# EAGLE design HAUPTPCB (EAGLE 7.1.0)
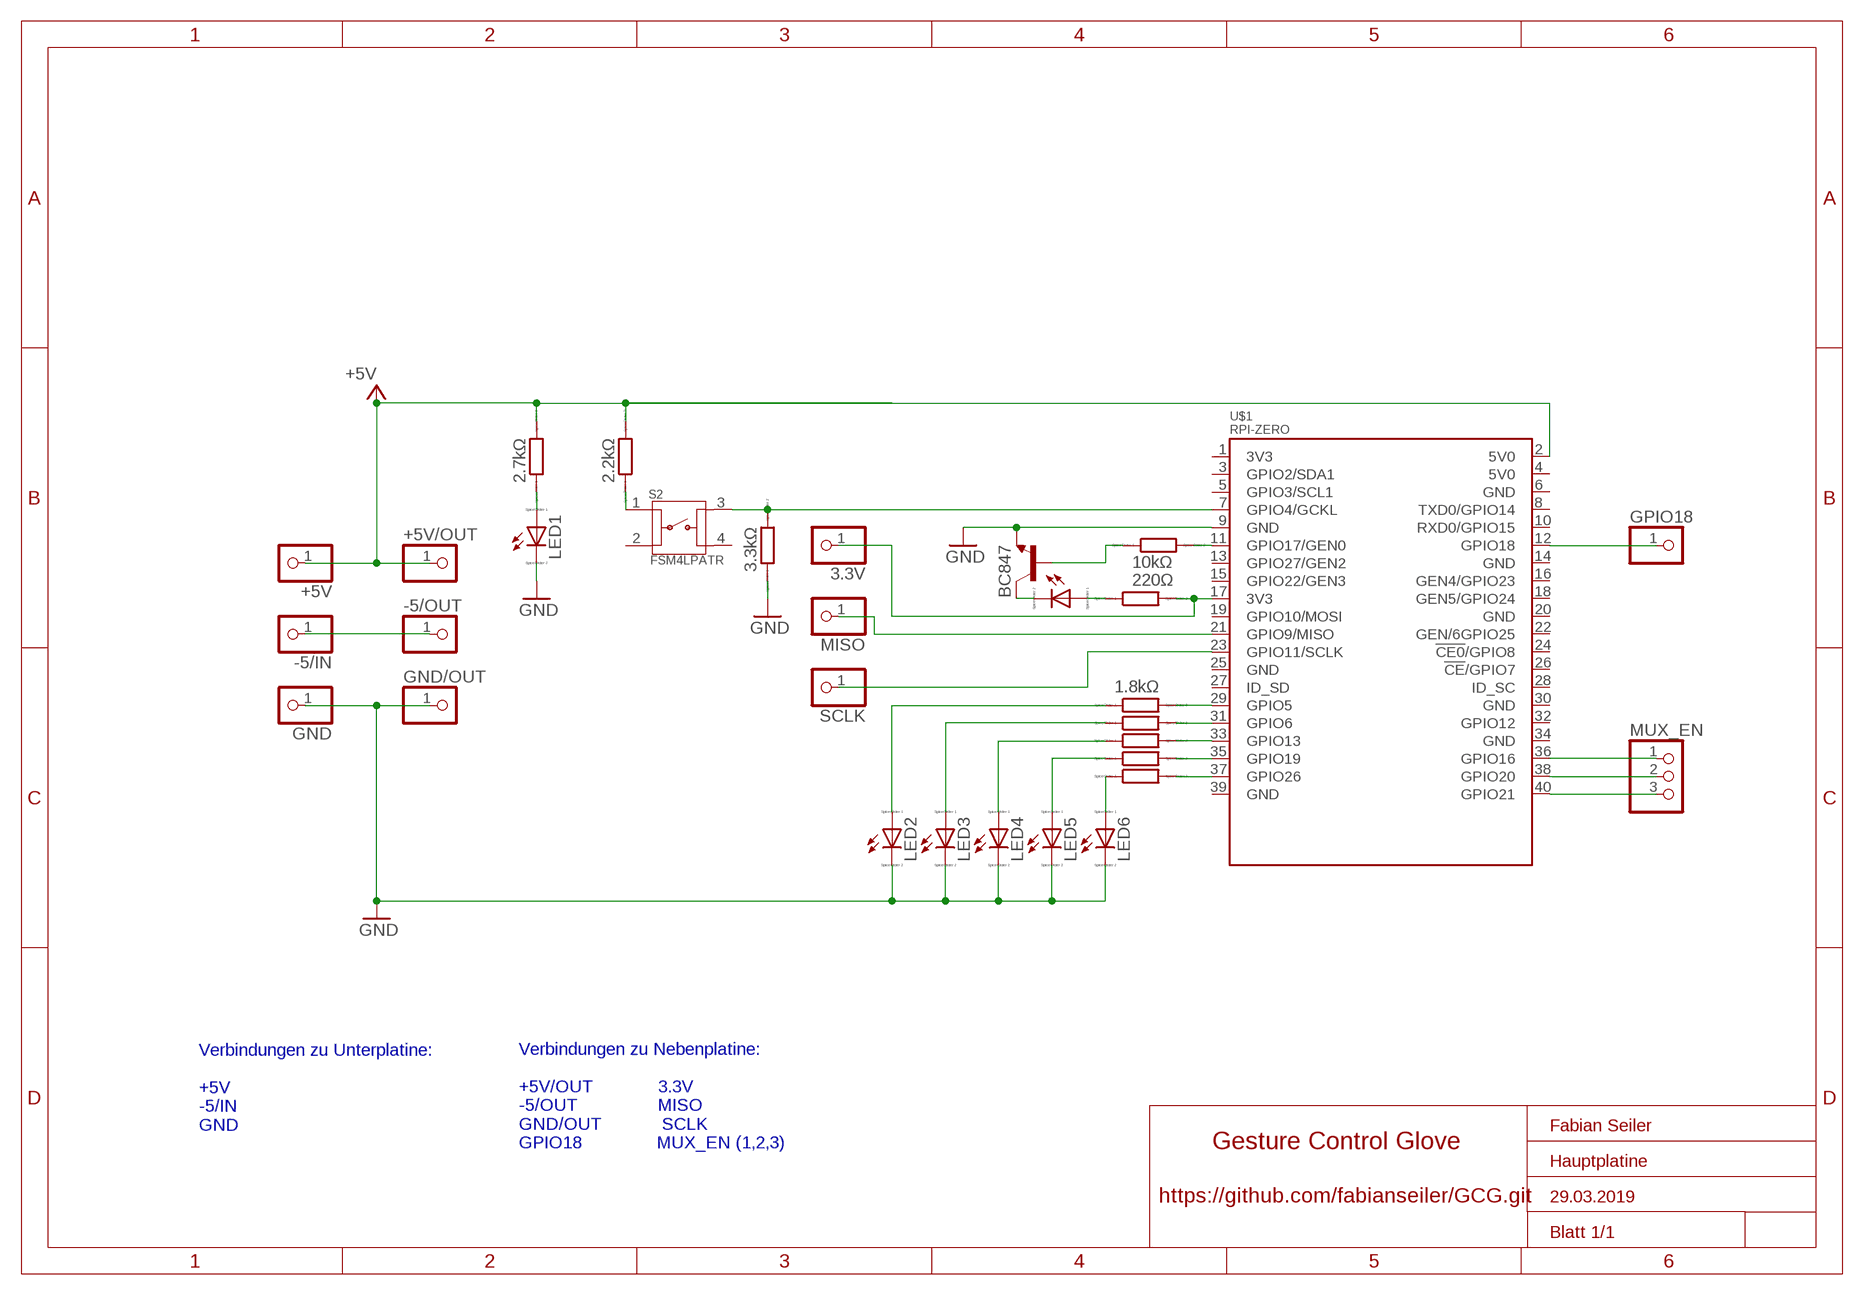
[diagram p0: schematic, sheet 1]

## Parts
3.3V  PINHD-1X1CB  [1X01-CLEANBIG]
+5V  PINHD-1X1CB  [1X01-CLEANBIG]
+5V/OUT  PINHD-1X1CB  [1X01-CLEANBIG]
-5/IN  PINHD-1X1CB  [1X01-CLEANBIG]
-5/OUT  PINHD-1X1CB  [1X01-CLEANBIG]
GND  PINHD-1X1CB  [1X01-CLEANBIG]
GND/OUT  PINHD-1X1CB  [1X01-CLEANBIG]
GPIO18  PINHD-1X1CB  [1X01-CLEANBIG]
LED1  LED_ESML0603  [LED_SML0603]
LED2  LED_ESML0603  [LED_SML0603]
LED3  LED_ESML0603  [LED_SML0603]
LED4  LED_ESML0603  [LED_SML0603]
LED5  LED_ESML0603  [LED_SML0603]
LED6  LED_ESML0603  [LED_SML0603]
LED_IR  LED_ELD260  [LED_LD260]
MISO  PINHD-1X1CB  [1X01-CLEANBIG]
MUX_EN  PINHD-1X3CB  [1X03-CLEANBIG]
R_IR1  10kΩ  R-EU_R0402  [R0402]
R_IR2  220Ω  R-EU_R0402  [R0402]
R_TTP1  2.7kΩ  R-EU_R0402  [R0402]
R_TTP9  2.2kΩ  R-EU_R0402  [R0402]
R_TTP10  3.3kΩ  R-EU_R0402  [R0402]
RL1  1.8kΩ  R-EU_R0402  [R0402]
RL2  R-EU_R0402  [R0402]
RL3  R-EU_R0402  [R0402]
RL4  R-EU_R0402  [R0402]
RL5  R-EU_R0402  [R0402]
S2  FSM4LPATR  [SW_FSM4LPATR]
SCLK  PINHD-1X1CB  [1X01-CLEANBIG]
T1  BC847  [SOT23]
U$1  RPI-ZERO  [RASPBERRYPI_BASTELSTUBE_V13_RASPI_BOARD_B+_FULL]

## Nets
3V3@2: 3.3V.1 R_IR2.2 U$1.17(3V3)
+5V: +5V.1 +5V/OUT.1 R_TTP1.2 R_TTP9.2 U$1.2(5V0)
GND: GND.1 GND/OUT.1 LED1.C LED2.C LED3.C LED4.C LED5.C LED6.C R_TTP10.1 T1.2(E) U$1.9(GND)
N$1: -5/IN.1 -5/OUT.1
N$2: LED_IR.K(C) T1.3(C)
N$3: MISO.1 U$1.21(GPIO9/MISO)
N$4: MUX_EN.3 U$1.40(GPIO21)
N$5: R_IR1.2 U$1.11(GPIO17/GEN0)
N$6: LED1.A R_TTP1.1
N$9: LED_IR.A R_IR2.1
N$10: R_TTP10.2 S2.3 U$1.7(GPIO4/GCKL)
N$13: LED5.A RL4.1
N$14: SCLK.1 U$1.23(GPIO11/SCLK)
N$16: LED4.A RL3.1
N$17: LED6.A RL5.1
N$18: LED3.A RL2.1
N$19: LED2.A RL1.1
N$24: MUX_EN.2 U$1.38(GPIO20)
N$25: MUX_EN.1 U$1.36(GPIO16)
N$26: GPIO18.1 U$1.12(GPIO18)
N$35: RL5.2 U$1.37(GPIO26)
N$36: RL4.2 U$1.35(GPIO19)
N$37: RL3.2 U$1.33(GPIO13)
N$38: RL1.2 U$1.29(GPIO5)
N$39: RL2.2 U$1.31(GPIO6)
N$47: R_IR1.1 T1.1(B)
N$66: R_TTP9.1 S2.1
Unconnected: S2.2 S2.4 U$1.1(3V3) U$1.3(GPIO2/SDA1) U$1.4(5V0) U$1.5(GPIO3/SCL1) U$1.6(GND) U$1.8(TXD0/GPIO14) U$1.10(RXD0/GPIO15) U$1.13(GPIO27/GEN2) U$1.14(GND) U$1.15(GPIO22/GEN3) U$1.16(GEN4/GPIO23) U$1.18(GEN5/GPIO24) U$1.19(GPIO10/MOSI) U$1.20(GND) U$1.22(GEN/6GPIO25) U$1.24(!CE0!/GPIO8) U$1.25(GND) U$1.26(!CE!/GPIO7) U$1.27(ID_SD) U$1.28(ID_SC) U$1.30(GND) U$1.32(GPIO12) U$1.34(GND) U$1.39(GND)

## Notes on the sheet
- Fabian Seiler
- Verbindungen zu Unterplatine:
  
  +5V
  -5/IN
  GND
- Gesture Control Glove
- Verbindungen zu Nebenplatine:
  
  +5V/OUT             3.3V
  -5/OUT                MISO
  GND/OUT            SCLK
  GPIO18               MUX_EN (1,2,3)
- Hauptplatine
- https://github.com/fabianseiler/GCG.git | 29.03.2019
- Blatt 1/1

## Library data of the parts
3.3V +5V +5V/OUT -5/IN -5/OUT GND GND/OUT GPIO18 MISO SCLK = adafruit:PINHD-1X1: Pin header 1x1 for 0.1" spacing With round pins
LED1-LED6 LED_IR = eagle-ltspice:LED_E: LED Source: http://www.osram.convergy.de Source: www.luxeon.com Source: www.kingbright.com; SPICEMODEL: NONE; SPICEPREFIX: D; SPICETYPE: diode
MUX_EN = adafruit:PINHD-1X3: PIN HEADER
R_IR1 R_IR2 R_TTP1 R_TTP9 R_TTP10 RL1-RL5 = resistor:R-EU_: RESISTOR, European symbol; SPICEPREFIX: R
S2 = FSM4LPATR:FSM4LPATR: Switch Tactile OFF (ON) SPST Round Button Gull Wing 0.05A 24VDC 2.55N SMD Loose; AVAILABILITY: Unavailable; DESCRIPTION: Switch Tactile OFF _ON_ SPST Round Button Gull Wing 0.05A 24VDC 2.55N SMD Loose; MF: TE Connectivity / Alcoswitch; MP: FSM4LPATR; PACKAGE: None; PRICE: None; TE_PURCHASE_URL: https://www.te.com/usa-en/product-FSM4LPATR.html?te_bu=Cor&te_type=disp&te_campaign=seda_glo_cor-seda-global-disp-prtnr-fy19-seda-model-bom-cta_sma-317_1&elqCampaignId=32493
T1 = transistor:BC847: NPN TRANSISTOR
U$1 = RPI-Zero:RPI-ZERO

## Board
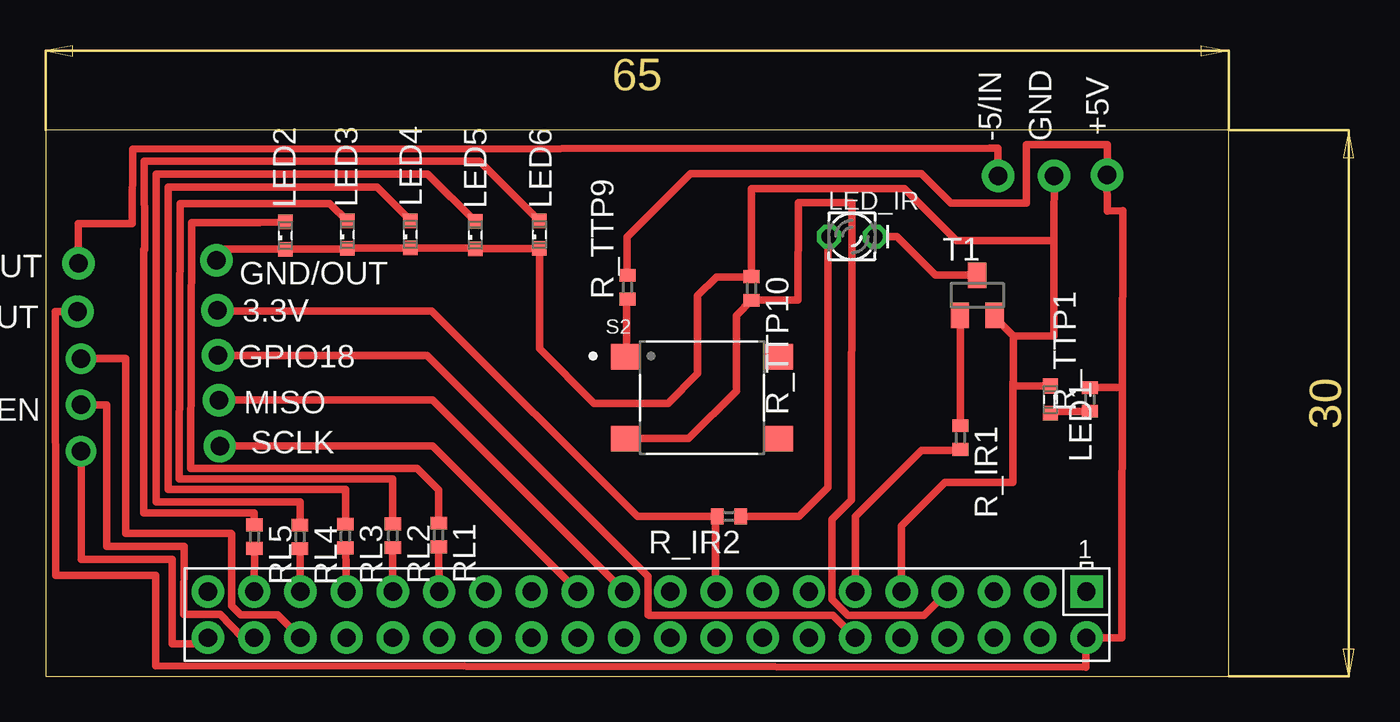
[diagram p1: board, top side]

Size 65 x 30 mm. Coordinates in mm from the lower left corner, seen from the top.
Outline: 0,0 65,0 65,30 0,30 0,0
Copper layers (1*16): Top 0.035mm / dielectric 1.5mm / Bottom 0.035mm
Design rules "default": minimum track width 10mil, minimum drill 24mil, track to track 8mil, track to pad 8mil, pad to pad 8mil, via to via 8mil, smd to smd 8mil, copper to edge 40mil, drill to drill 8mil, minimum pad ring 10mil, minimum via ring 8mil, stop-mask expansion 4mil, vias tented up to drill 0mil, thermal gap 10mil

### Footprints (pad centres in the part's own frame; a part is rotated, then mirrored left to right if it is on the bottom)
1X01-CLEANBIG = drill 1.016 pad 1.778: 1 0,0
LED_SML0603 = smd 0.8 x 0.8: A 0.75,0; C -0.75,0
LED_LD260 = drill 0.813 octagon: A -1.27,0; K 1.27,0
1X03-CLEANBIG = drill 1.016 pad 1.676: 1 -2.54,0; 2 0,0; 3 2.54,0
R0402 = smd 0.7 x 0.9: 1 -0.65,0; 2 0.65,0
SW_FSM4LPATR = smd 1.6 x 1.4: 1 -4.2,2.25; 2 4.2,2.25; 3 -4.2,-2.25; 4 4.2,-2.25
SOT23 = smd 1 x 1.4: 1 -0.95,-1.1; 2 0.95,-1.1; 3 0,1.1
RASPBERRYPI_BASTELSTUBE_V13_RASPI_BOARD_B+_FULL = drill 1 pad 1.778 square: 1 8.37,25.23 | drill 1 pad 1.778: 2 8.37,27.77; 3 10.91,25.23; 4 10.91,27.77; 5 13.45,25.23; 6 13.45,27.77; 7 15.99,25.23; 8 15.99,27.77; 9 18.53,25.23; 10 18.53,27.77; 11 21.07,25.23; 12 21.07,27.77; 13 23.61,25.23; 14 23.61,27.77; 15 26.15,25.23; 16 26.15,27.77; 17 28.69,25.23; 18 28.69,27.77; 19 31.23,25.23; 20 31.23,27.77; 21 33.77,25.23; 22 33.77,27.77; 23 36.31,25.23; 24 36.31,27.77; 25 38.85,25.23; 26 38.85,27.77; 27 41.39,25.23; 28 41.39,27.77; 29 43.93,25.23; 30 43.93,27.77; 31 46.47,25.23; 32 46.47,27.77; 33 49.01,25.23; 34 49.01,27.77; 35 51.55,25.23; 36 51.55,27.77; 37 54.09,25.23; 38 54.09,27.77; 39 56.63,25.23; 40 56.63,27.77

### Placement (x,y rotation side)
3.3V  9.45,20.11 0 top
+5V  58.31,27.55 0 top
+5V/OUT  1.75,20.04 0 top
-5/IN  52.32,27.51 0 top
-5/OUT  1.81,22.69 0 top
GND  55.41,27.5 0 top
GND/OUT  9.39,22.86 0 top
GPIO18  9.47,17.63 0 top
LED1  55.2,15.2 270 top
LED2  13.18,24.21 90 top
LED3  16.58,24.27 90 top
LED4  20.04,24.28 90 top
LED5  23.61,24.24 90 top
LED6  27.13,24.27 90 top
LED_IR  44.3,24.17 0 top
MISO  9.52,15.17 0 top
MUX_EN  1.95,14.92 270 top
R_IR1  50.25,13.12 270 top
R_IR2  37.54,8.78 180 top
R_TTP1  57.36,15.21 90 top
R_TTP9  31.97,21.38 90 top
R_TTP10  38.78,21.31 270 top
RL1  21.6,7.76 270 top
RL2  19.08,7.72 270 top
RL3  16.47,7.71 270 top
RL4  13.98,7.66 270 top
RL5  11.48,7.67 270 top
S2  36.07,15.3 0 top
SCLK  9.57,12.65 0 top
T1  51.18,20.93 0 top
U$1  65.55,29.89 180 top

### Tracks (layer width: path | path; a pad name or v marks a point on that pad's centre or on a via)
3V3@2
  Top 0.406: U$1.17 36.8,4.66 36.8,8.7 R_IR2.2 32.51,8.79 21.21,20.08 9.48,20.08 3.3V.1
+5V
  Top 0.406: 59.15,16.07 59.13,6.61 59.11,6.58 59.11,2.12 U$1.2 57.15,2.12 57.15,0.51 6.04,0.57 6.04,5.54 0.57,5.56 0.53,20.05 1.75,20.05 +5V/OUT.1 | 59.15,16.07 59.18,25.6 58.33,25.57 +5V.1 58.32,27.55 58.32,29.21 53.89,29.21 53.89,25.99 49.73,25.99 48.11,27.61 35.44,27.61 31.95,24.12 31.95,22.04 R_TTP9.2 | R_TTP1.2 59.15,15.86 59.15,16.07
GND
  Top 0.406: 53.17,16.19 53.17,15.95 LED1.C | 53.17,16.19 53.17,18.69 | 53.17,18.69 55.38,18.69 55.38,19.74 | 55.38,19.74 55.39,23.92 | 55.39,23.92 55.4,24.78 GND.1 | GND/OUT.1 9.38,23.47 LED2.C 16.53,23.46 LED3.C 20.03,23.52 LED4.C 23.57,23.53 LED5.C 27.11,23.49 LED6.C 27.13,18.01 30.14,15 34.19,15 35.82,16.64 35.82,20.91 36.85,21.94 38.76,21.94 R_TTP10.1 38.78,26.8 47.19,26.8 50.05,23.95 55.37,23.95 55.39,23.92 | 55.38,19.95 55.38,19.74 | U$1.9 47.02,8.27 49.4,10.64 53.14,10.64 53.14,16.16 53.17,16.19 | T1.2 52.13,19.73 53.17,18.69
N$1
  Top 0.406: -5/OUT.1 1.81,24.86 4.75,24.86 4.79,28.97 51.84,29.01 52.32,29.01 -5/IN.1
N$2
  Top 0.406: T1.3 48.89,22.03 46.76,24.17 LED_IR.K
N$3
  Top 0.406: MISO.1 21.27,15.17 U$1.21
N$4
  Top 0.406: MUX_EN.3 1.97,12.38 1.97,6.41 6.96,6.41 6.96,1.78 8.92,1.78 U$1.40
N$5
  Top 0.406: U$1.11 44.48,8.77 48.12,12.41 49.72,12.41 R_IR1.2
N$6
  Top 0.406: R_TTP1.1 55.2,14.56 LED1.A
N$9
  Top 0.406: LED_IR.A 42.98,24.12 42.98,10.38 41.38,8.79 R_IR2.1
N$10
  Top 0.406: 38.7,20.66 R_TTP10.2 | R_TTP10.2 41.33,20.66 41.35,26.02 44.29,26.02 44.28,9.68 43.21,8.62 43.21,4.24 44.09,3.36 48.26,3.36 U$1.7 | S2.3 35.32,13.05 37.94,15.68 37.94,19.82 R_TTP10.2
N$13
  Top 0.406: RL4.1 13.99,9.59 6.08,9.59 6.07,27.6 21,27.6 LED5.A
N$14
  Top 0.406: SCLK.1 21.25,12.64 U$1.23
N$16
  Top 0.406: RL3.1 16.48,10.27 6.73,10.27 6.74,26.87 18.21,26.87 LED4.A
N$17
  Top 0.406: RL5.1 11.46,8.97 5.4,8.97 5.4,23.44 5.44,23.44 5.42,28.31 23.84,28.31 LED6.A
N$18
  Top 0.406: RL2.1 19.08,10.85 7.35,10.85 7.39,25.98 15.62,25.98 LED3.A
N$19
  Top 0.406: LED2.A 11.78,24.92 8.02,24.92 7.96,11.43 20.4,11.43 21.59,10.24 RL1.1
N$24
  Top 0.406: MUX_EN.2 3.35,14.9 3.35,7.14 7.62,7.14 7.58,3.4 9.61,3.4 10.81,2.14 11.44,2.14 U$1.38
N$25
  Top 0.406: MUX_EN.1 4.42,17.46 4.42,7.85 10.2,7.85 10.23,7.82 10.23,3.86 10.72,3.37 12.74,3.37 U$1.36
N$26
  Top 0.406: U$1.12 43.25,3.34 33.14,3.34 33.1,3.38 33.1,5.48 20.95,17.63 GPIO18.1
N$35
  Top 0.406: U$1.37 RL5.2
N$36
  Top 0.406: U$1.35 RL4.2
N$37
  Top 0.406: U$1.33 RL3.2
N$38
  Top 0.406: U$1.29 RL1.2
N$39
  Top 0.406: U$1.31 RL2.2
N$47
  Top 0.406: R_IR1.1 50.25,19.81 T1.1
N$66
  Top 0.406: S2.1 31.91,17.55 31.91,20.67 R_TTP9.1